# Altium schematic sheet 2020-05-30_00-24-191.schdoc
size 360 x 175 mm; SheetNumber: 1; SheetTotal: 1
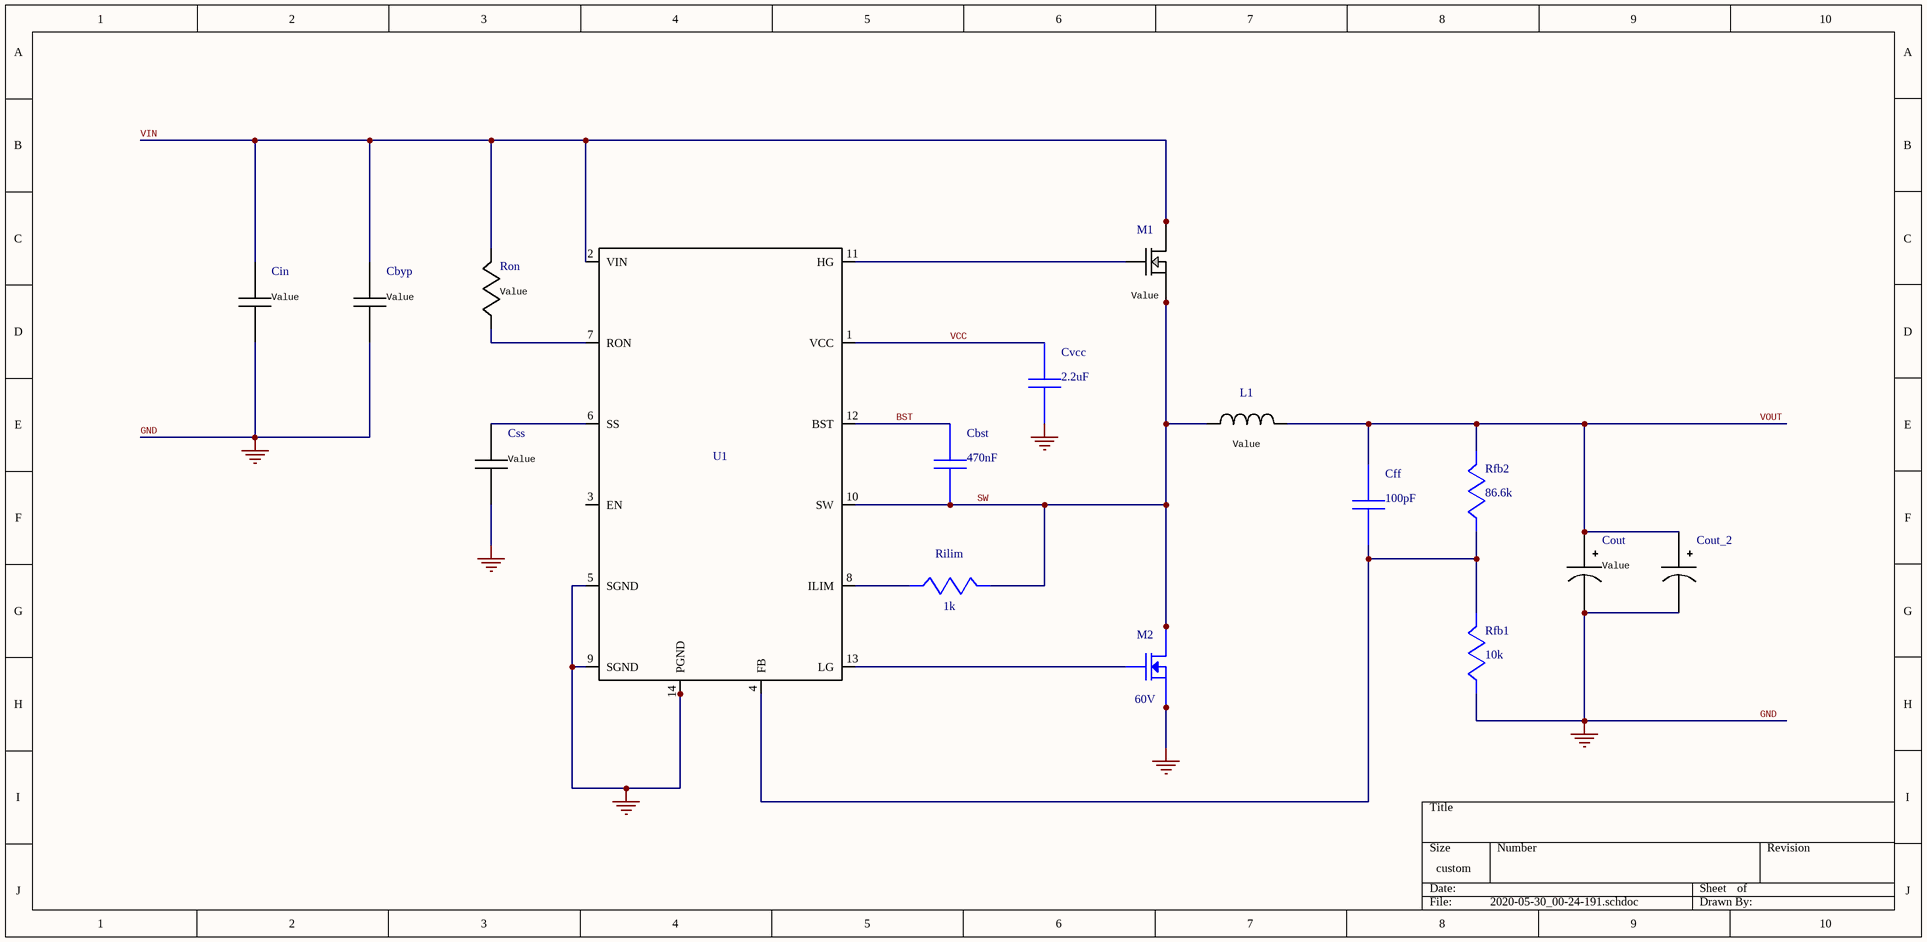
[diagram p0: 2020-05-30_00-24-191.schdoc]

## Parts
Cbst  value 470nF  (hidden comment: ECPU1C474MA5)
Cbyp  C0805C101K5GACTU  [0805]  (value not drawn)
Cff  value 100pF  (hidden comment: C0805C101K5GACTU)
Cin  C2012X5R1V106K08  [0805]  (value not drawn)
Cout  EEFCS1A470R  [7343-15]  (value not drawn)
Cout_2  EEFCS1A470R  [7343-15]  (value not drawn)
Css  CGA4F2C0G1H153J0  [0805]  (value not drawn)
Cvcc  value 2.2uF  (hidden comment: EMK212BJ225KG-T)
L1  SRP1235-4R7M  [SRP1235]  (value not drawn)
M1  CSD18534Q5A  [TRANS_NexFET_Q5A]  (value not drawn)
M2  value 60V  (hidden comment: CSD18534Q5A)
Rfb1  value 10k  (hidden comment: CRCW080510K0FKEA)
Rfb2  value 86.6k  (hidden comment: CRCW080586K6FKEA)
Rilim  value 1k  (hidden comment: ERJ-6ENF1001V)
Ron  CRCW080588K7FKEA  [0805]  (value not drawn)
U1  LM3150MH/NOPB  [MXA14A]  (value not drawn)

## Nets
GND: Cbyp.2 Cin.2 Cout.2(-) Cout_2.2(-) Css.2 Cvcc.2 M2.1(Source) M2.2(Source) M2.3(Source) Rfb1.2 U1.5(SGND) U1.9(SGND) U1.14(PGND) U1.15(PGND)  [also labelled 0]
BST: Cbst.1 U1.12(BST)
SW: Cbst.2 L1.1 M1.1(Source) M1.2(Source) M1.3(Source) M2.5(Drain) M2.6(Drain) M2.7(Drain) M2.8(Drain) M2.9(Drain) Rilim.1 U1.10(SW)
VCC: Cvcc.1 U1.1(VCC)
VIN: Cbyp.1 Cin.1 M1.5(Drain) M1.6(Drain) M1.7(Drain) M1.8(Drain) M1.9(Drain) Ron.1 U1.2(VIN)
VOUT: Cff.1 Cout.1(+) Cout_2.1(+) L1.2 Rfb2.1
NetCff_2: Cff.2 Rfb1.1 Rfb2.2 U1.4(FB)
NetCss_1: Css.1 U1.6(SS)
NetM1_4: M1.4(Gate) U1.11(HG)
NetM2_4: M2.4(Gate) U1.13(LG)
NetRilim_2: Rilim.2 U1.8(ILIM)
NetRon_2: Ron.2 U1.7(RON)

Not connected (* = marked no-connect by the designer): U1 3(EN)

## Library data of the parts
Cbst = ECPU1C474MA5: Manufacturer Name: Panasonic; PackageReference: ECPU1C474MA5; Manufacturer Part Number: ECPU1C474MA5
Cbyp = C0805C101K5GACTU: Imported; Vendor: Kemet; Value: Value; Manufacturer_Part_Number: C0805C101K5GACTU; Manufacturer_Name: Kemet; RefDes: RefDes; TYPE: TYPE
Cff = C0805C101K5GACTU: Manufacturer Name: Kemet; PackageReference: C0805C101K5GACTU; Manufacturer Part Number: C0805C101K5GACTU
Cin = C2012X5R1V106K08: Imported; Manufacturer_Part_Number: C2012X5R1V106K085AC; Vendor: TDK; Value: Value; Manufacturer_Name: TDK; RefDes: RefDes; TYPE: TYPE
Cout Cout_2 = EEFCS1A470R: Imported; Vendor: Panasonic; Value: Value; Manufacturer_Part_Number: EEFCS1A470R; Manufacturer_Name: Panasonic; RefDes: RefDes; TYPE: TYPE
Css = CGA4F2C0G1H153J0: Imported; Manufacturer_Part_Number: CGA4F2C0G1H153J085AA; Vendor: TDK; Value: Value; Manufacturer_Name: TDK; RefDes: RefDes; TYPE: TYPE
Cvcc = EMK212BJ225KG-T: Manufacturer Name: Taiyo Yuden; PackageReference: EMK212BJ225KG-T; Manufacturer Part Number: EMK212BJ225KG-T
L1 = SRP1235-4R7M: Imported; Vendor: Bourns; Value: Value; Manufacturer_Part_Number: SRP1235-4R7M; Manufacturer_Name: Bourns; RefDes: RefDes; TYPE: TYPE
M1 = CSD18534Q5A: Imported; Vendor: Texas Instruments; Value: Value; Manufacturer_Part_Number: CSD18534Q5A; Manufacturer_Name: Texas Instruments; RefDes: RefDes; TYPE: TYPE
M2 = CSD18534Q5A: Manufacturer Name: Texas Instruments; PackageReference: CSD18534Q5A; Manufacturer Part Number: CSD18534Q5A
Rfb1 = CRCW080510K0FKEA: Manufacturer Name: Vishay-Dale; PackageReference: CRCW080510K0FKEA; Manufacturer Part Number: CRCW080510K0FKEA
Rfb2 = CRCW080586K6FKEA: Manufacturer Name: Vishay-Dale; PackageReference: CRCW080586K6FKEA; Manufacturer Part Number: CRCW080586K6FKEA
Rilim = ERJ-6ENF1001V: Manufacturer Name: Panasonic; PackageReference: ERJ-6ENF1001V; Manufacturer Part Number: ERJ-6ENF1001V
Ron = CRCW080588K7FKEA: Imported; Vendor: Vishay-Dale; Value: Value; Manufacturer_Part_Number: CRCW080588K7FKEA; Manufacturer_Name: Vishay-Dale; RefDes: RefDes; TYPE: TYPE
U1 = LM3150MH/NOPB: Imported; Vendor: Texas Instruments; Value: Value; Manufacturer_Part_Number: LM3150MH/NOPB; Manufacturer_Name: Texas Instruments; RefDes: RefDes; TYPE: TYPE